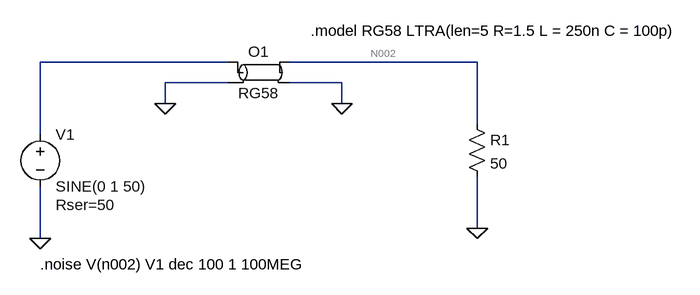
[diagram p0: schematic 5.asc]
5.asc, the LTspice schematic file:
Version 4
SHEET 1 1008 680
WIRE 272 64 -16 64
WIRE 656 64 368 64
WIRE 272 96 176 96
WIRE 448 96 368 96
WIRE 176 128 176 96
WIRE 448 128 448 96
WIRE 656 160 656 64
WIRE -16 176 -16 64
WIRE 656 320 656 240
WIRE -16 336 -16 256
FLAG -16 336 0
FLAG 656 320 0
FLAG 176 128 0
FLAG 448 128 0
SYMBOL voltage -16 160 R0
WINDOW 123 0 0 Left 0
WINDOW 39 24 124 Left 2
SYMATTR InstName V1
SYMATTR Value SINE(0 1 50)
SYMATTR SpiceLine Rser=50
SYMBOL res 640 144 R0
SYMATTR InstName R1
SYMATTR Value 50
SYMBOL ltline 320 80 R0
SYMATTR InstName O1
SYMATTR Value RG58
TEXT -16 376 Left 2 !.noise V(n002) V1 dec 100 1 100MEG
TEXT 400 16 Left 2 !.model RG58 LTRA(len=5 R=1.5 L = 250n C = 100p)

The netlist it stands for:
* 5.asc
V1 N001 0 SINE(0 1 50) Rser=50
R1 N002 0 50
O1 N001 0 N002 0 RG58
.noise V(n002) V1 dec 100 1 100MEG
.model RG58 LTRA(len=5 R=1.5 L = 250n C = 100p)
.backanno
.end